# EAGLE design placa_tampa (EAGLE 9.6.2)
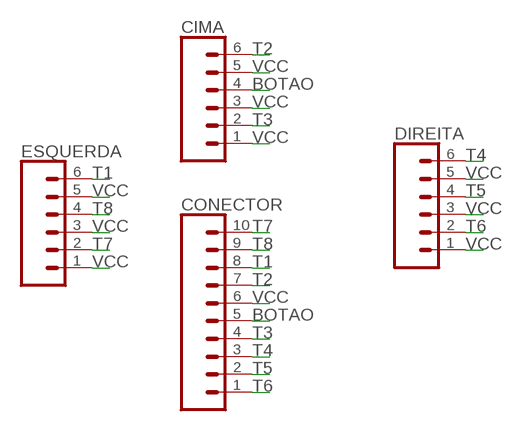
[diagram p0: schematic, sheet 1]

## Parts
CIMA  CONN_06SILK_FEMALE_PTH  [1X06]
CONECTOR  CONN_10"  [1X10]
DIREITA  CONN_06SILK_FEMALE_PTH  [1X06]
ESQUERDA  CONN_06SILK_FEMALE_PTH  [1X06]

## Nets
BOTAO: CIMA.4 CONECTOR.5
T1: CONECTOR.8 ESQUERDA.6
T2: CIMA.6 CONECTOR.7
T3: CIMA.2 CONECTOR.4
T4: CONECTOR.3 DIREITA.6
T5: CONECTOR.2 DIREITA.4
T6: CONECTOR.1 DIREITA.2
T7: CONECTOR.10 ESQUERDA.2
T8: CONECTOR.9 ESQUERDA.4
VCC: CIMA.1 CIMA.3 CIMA.5 CONECTOR.6 DIREITA.1 DIREITA.3 DIREITA.5 ESQUERDA.1 ESQUERDA.3 ESQUERDA.5

## Library data of the parts
CIMA DIREITA ESQUERDA = SparkFun-Connectors:CONN_06: Multi connection point. Often used as Generic Header-pin footprint for 0.1 inch spaced/style header connections On any of the 0.1 inch spaced packages, you can populate with these: Break Away Headers - Straight <https://www.sparkfun.com/products/116> (PRT-00116) Break Away Male Headers - Right Angle <https://www.sparkfun.com/products/553> (PRT-00553) Female Headers <https://www.sparkfun.com/products/115> (PRT-00115) Break Away Headers - Machine Pin <https://www.sparkfun.com/products/117> (PRT-00117) Break Away Female Headers - Swiss Machine Pin <https://www.sparkfun.com/products/743> (PRT-00743) Arduino Stackable Header - 6 Pin <https://www.sparkfun.com/products/9280> (PRT-09280) For SCREWTERMINALS and SPRING TERMINALS visit here: Screw Terimnals on SparkFun.com <https://www.sparkfun.com/search/results?term=Screw+Terminals> (5mm/3.5mm/2.54mm spacing) This device is also useful as a general connection point to wire up your design to another part of your project. Our various solder wires solder well into these plated through hole pads. Hook-Up Wire - Assortment (Stranded, 22 AWG) <https://www.sparkfun.com/products/11375> (PRT-11375) Hook-Up Wire - Assortment (Solid Core, 22 AWG) <https://www.sparkfun.com/products/11367> (PRT-11367) View the entire wire category on our website here <https://www.sparkfun.com/categories/141>; PROD_ID: CONN-08437
CONECTOR = SparkFun-Connectors:CONN_10: Multi connection point. Often used as Generic Header-pin footprint for 0.1 inch spaced/style header connections On any of the 0.1 inch spaced packages, you can populate with these: Break Away Headers - Straight <https://www.sparkfun.com/products/116> (PRT-00116) Break Away Male Headers - Right Angle <https://www.sparkfun.com/products/553> (PRT-00553) Female Headers <https://www.sparkfun.com/products/115> (PRT-00115) Break Away Headers - Machine Pin <https://www.sparkfun.com/products/117> (PRT-00117) Break Away Female Headers - Swiss Machine Pin <https://www.sparkfun.com/products/743> (PRT-00743) Arduino Stackable Header - 10 Pin <https://www.sparkfun.com/products/11376> (PRT-11376) For SCREWTERMINALS and SPRING TERMINALS visit here: Screw Terimnals on SparkFun.com <https://www.sparkfun.com/search/results?term=Screw+Terminals> (5mm/3.5mm/2.54mm spacing) This device is also useful as a general connection point to wire up your design to another part of your project. Our various solder wires solder well into these plated through hole pads. Hook-Up Wire - Assortment (Stranded, 22 AWG) <https://www.sparkfun.com/products/11375> (PRT-11375) Hook-Up Wire - Assortment (Solid Core, 22 AWG) <https://www.sparkfun.com/products/11367> (PRT-11367) View the entire wire category on our website here <https://www.sparkfun.com/categories/141> Special notes: Molex polarized connector foot print use with SKU : PRT-08231 with associated crimp pins and housings. 1MM SMD Version SKU: PRT-10208 NOTES ON THE VARIANTS LOCK and LOCK_LONGPADS... This footprint was designed to help hold the alignment of a through-hole component (i.e. 6-pin header) while soldering it into place. You may notice that each hole has been shifted either up or down by 0.005 of an inch from it's more standard position (which is a perfectly straight line). This slight alteration caused the pins (the squares in the middle) to touch the edges of the holes. Because they are alternating, it causes a "brace" to hold the component in place. 0.005 has proven to be the perfect amount of "off-center" position when using our standard breakaway headers. Although looks a little odd when you look at the bare footprint, once you have a header in there, the alteration is very hard to notice. Also,if you push a header all the way into place, it is covered up entirely on the bottom side.; PROD_ID: CONN-11563

## Board
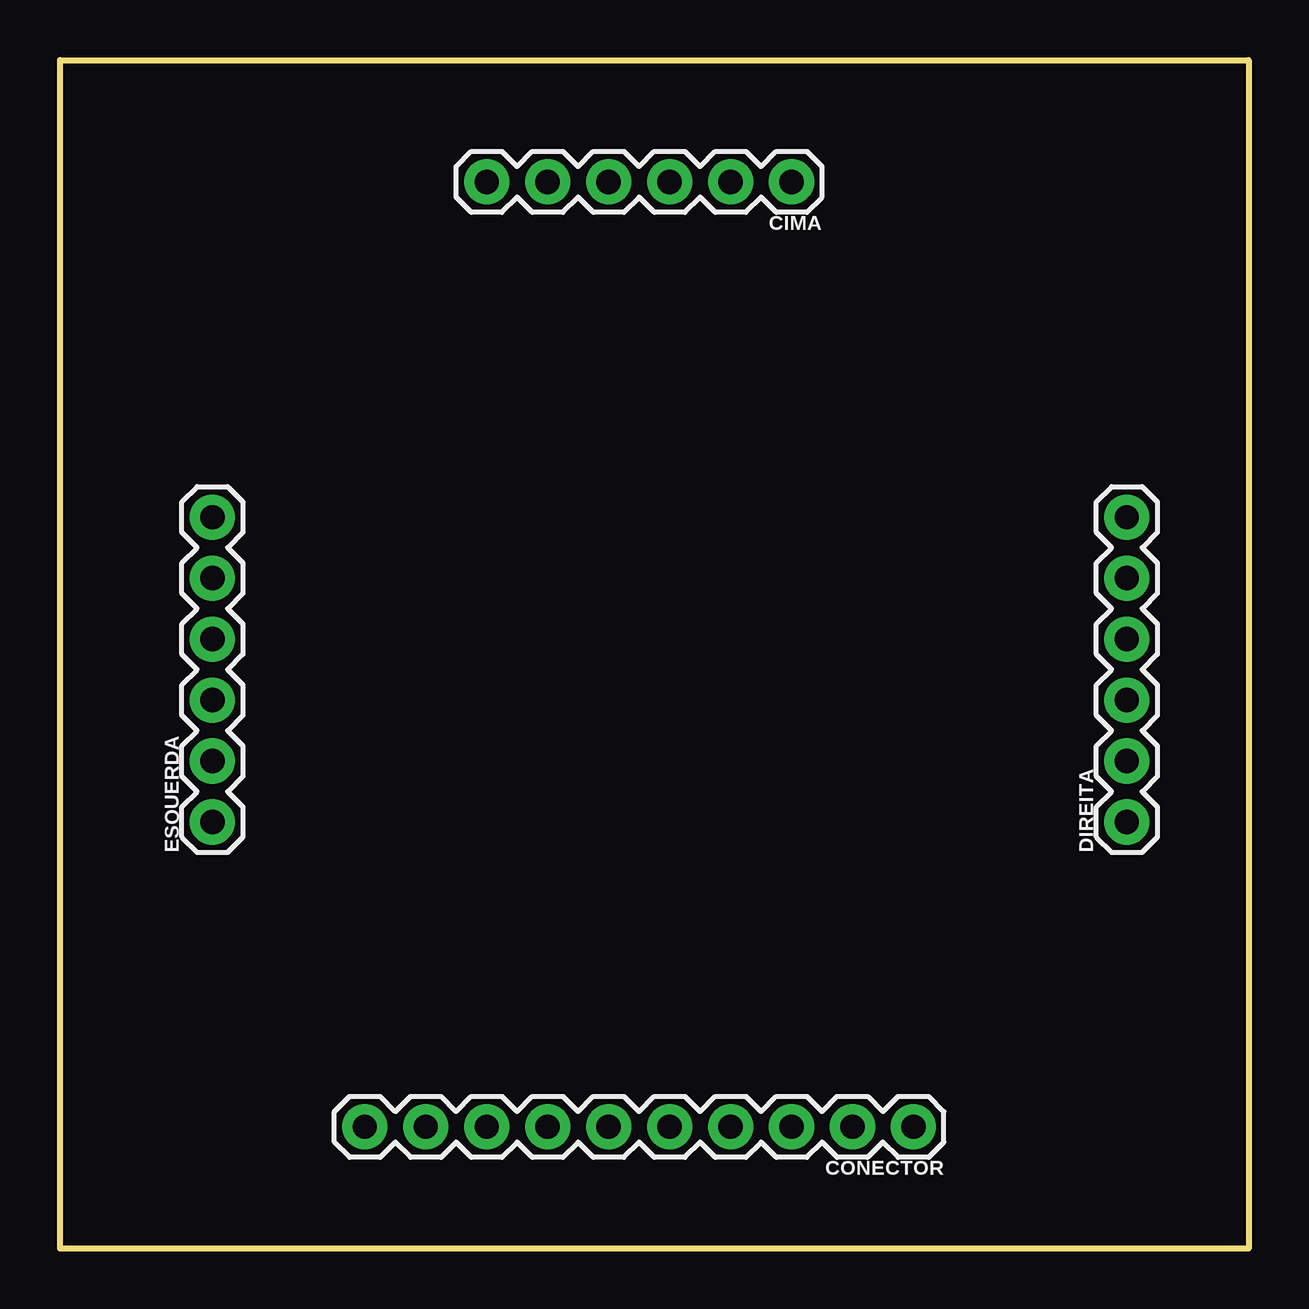
[diagram p1: board, top side]
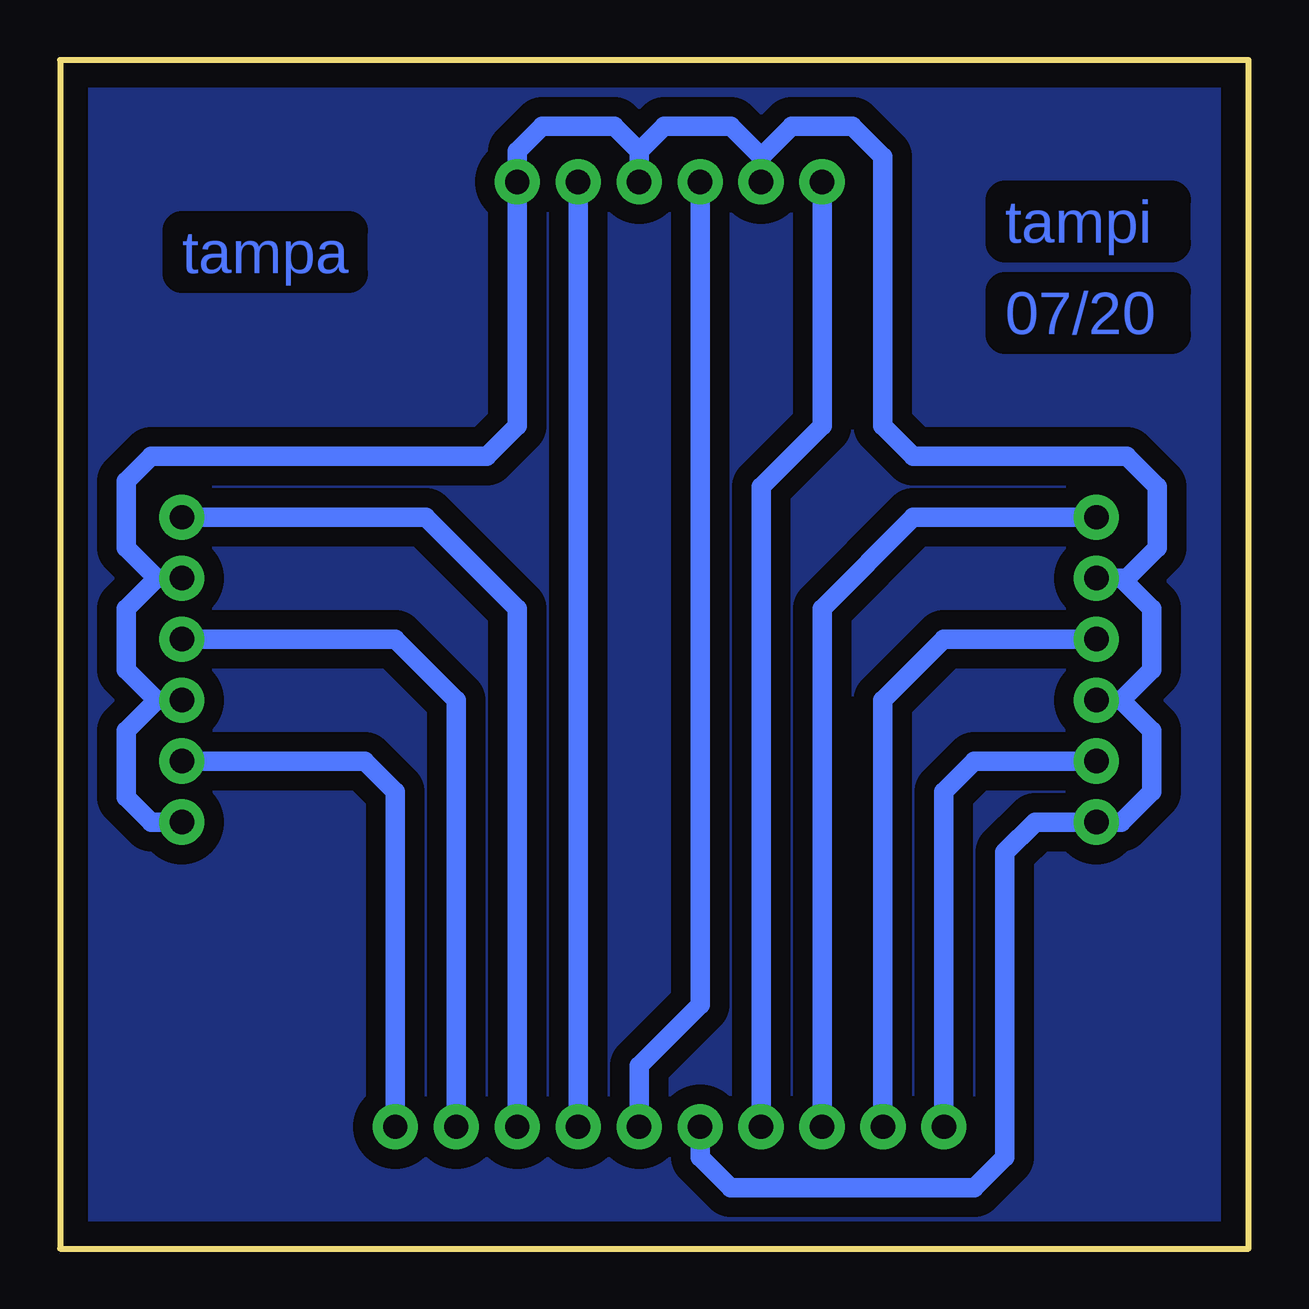
[diagram p2: board, bottom side, seen from below]

Size 49.53 x 49.53 mm. Coordinates in mm from the lower left corner, seen from the top.
Outline: 0,0 0,49.53 49.53,49.53 49.53,0 0,0
Copper layers (1*16): Top 0.035mm / dielectric 1.5mm / Bottom 0.035mm
Design rules "default": minimum track width 6mil, minimum drill 0.35mm, track to track 6mil, track to pad 6mil, pad to pad 6mil, via to via 6mil, smd to smd 6mil, copper to edge 40mil, drill to drill 6mil, minimum pad ring 10mil, minimum via ring 8mil, stop-mask expansion 4mil, vias tented up to drill 0mil, thermal gap 10mil

### Footprints (pad centres in the part's own frame; a part is rotated, then mirrored left to right if it is on the bottom)
1X06 = drill 1.016 pad 1.88: 1 0,0; 2 2.54,0; 3 5.08,0; 4 7.62,0; 5 10.16,0; 6 12.7,0
1X10 = drill 1.016 pad 1.88: 1 0,0; 2 2.54,0; 3 5.08,0; 4 7.62,0; 5 10.16,0; 6 12.7,0; 7 15.24,0; 8 17.78,0; 9 20.32,0; 10 22.86,0

### Placement (x,y rotation side)
CIMA  30.48,44.45 180 top
CONECTOR  35.56,5.08 180 top
DIREITA  44.45,17.78 90 top
ESQUERDA  6.35,17.78 90 top

### Tracks (layer width: path | path; a pad name or v marks a point on that pad's centre or on a via)
BOTAO
  Bottom 0.813: CIMA.4 22.86,10.16 25.4,7.62 CONECTOR.5
GND
  pour Bottom (isolate 0.813): 0,0 49.53,0 49.53,49.53 0,49.53
T1
  Bottom 0.813: ESQUERDA.6 13.97,30.48 17.78,26.67 CONECTOR.8
T2
  Bottom 0.813: CIMA.6 17.78,34.29 20.32,31.75 CONECTOR.7
T3
  Bottom 0.813: CONECTOR.4 CIMA.2
T4
  Bottom 0.813: CONECTOR.3 30.48,26.67 34.29,30.48 DIREITA.6
T5
  Bottom 0.813: DIREITA.4 35.56,25.4 33.02,22.86 CONECTOR.2
T6
  Bottom 0.813: DIREITA.2 36.83,20.32 35.56,19.05 CONECTOR.1
T7
  Bottom 0.813: ESQUERDA.2 11.43,20.32 12.7,19.05 CONECTOR.10
T8
  Bottom 0.813: ESQUERDA.4 12.7,25.4 15.24,22.86 CONECTOR.9
VCC
  Bottom 0.813: 25.4,45.72 26.44,46.76 29.44,46.76 30.48,45.72 CIMA.1 30.48,34.29 31.75,33.02 45.72,33.02 46.76,31.98 46.76,29.21 45.49,27.94 | CIMA.3 25.4,45.72 | 25.4,45.72 24.36,46.76 21.59,46.76 20.32,45.49 | CIMA.5 20.32,45.49 | 20.32,45.49 19.05,46.76 16.51,46.76 15.24,45.49 15.24,34.29 13.97,33.02 5.08,33.02 3.81,31.75 3.81,29.21 5.08,27.94 5.31,27.94 | 5.31,27.94 ESQUERDA.5 | 5.31,27.94 4.04,26.67 4.04,24.13 5.31,22.86 | 5.31,22.86 ESQUERDA.3 | 5.31,22.86 4.04,21.59 4.04,19.05 5.31,17.78 ESQUERDA.1 8.89,17.78 10.16,16.51 10.16,3.81 11.43,2.54 21.59,2.54 22.86,3.81 CONECTOR.6 | DIREITA.1 45.72,17.78 46.76,18.82 46.76,21.59 45.49,22.86 | DIREITA.3 45.49,22.86 | 45.49,22.86 46.76,24.13 46.76,26.67 45.49,27.94 | 45.49,27.94 DIREITA.5

### Text on the board
Bottom: tampi | tampa | 07/20